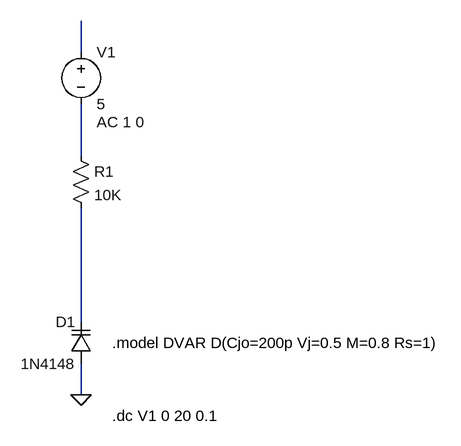
[diagram p0: schematic PARTA.asc]
PARTA.asc, the LTspice schematic file:
Version 4.1
SHEET 1 880 680
WIRE 144 64 144 16
WIRE 144 224 144 144
WIRE 144 480 144 304
WIRE 144 592 144 544
FLAG 144 592 0
SYMBOL voltage 144 48 R0
WINDOW 123 24 124 Left 2
WINDOW 39 0 0 Left 0
SYMATTR InstName V1
SYMATTR Value 5
SYMATTR Value2 AC 1 0
SYMBOL res 128 208 R0
SYMATTR InstName R1
SYMATTR Value 10K
SYMBOL varactor 160 544 R180
WINDOW 0 24 64 Left 2
WINDOW 3 24 0 Left 2
SYMATTR InstName D1
SYMATTR Value 1N4148
TEXT 192 512 Left 2 !.model DVAR D(Cjo=200p Vj=0.5 M=0.8 Rs=1)
TEXT 192 624 Left 2 !.dc V1 0 20 0.1

The netlist it stands for:
* PARTA.asc
V1 N001 N002 5 AC 1 0
R1 N002 N003 10K
D1 0 N003 1N4148
.model D D
.lib standard.dio
.model DVAR D(Cjo=200p Vj=0.5 M=0.8 Rs=1)
.dc V1 0 20 0.1
.backanno
.end